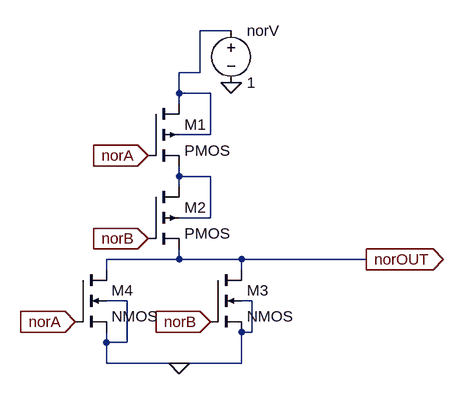
[diagram p0: schematic Draft7.asc]
Draft7.asc, the LTspice schematic file:
Version 4
SHEET 1 880 680
WIRE 320 -96 272 -96
WIRE 272 -32 272 -96
WIRE 272 -32 240 -32
WIRE 240 0 240 -32
WIRE 288 0 240 0
WIRE 240 16 240 0
WIRE 288 64 288 0
WIRE 288 64 240 64
WIRE 240 128 240 112
WIRE 288 128 240 128
WIRE 240 144 240 128
WIRE 288 192 288 128
WIRE 288 192 240 192
WIRE 240 256 240 240
WIRE 240 256 128 256
WIRE 336 256 240 256
WIRE 528 256 336 256
WIRE 128 272 128 256
WIRE 336 272 336 256
WIRE 160 320 128 320
WIRE 352 320 336 320
WIRE 352 368 352 320
WIRE 352 368 336 368
WIRE 128 384 128 368
WIRE 160 384 160 320
WIRE 160 384 128 384
WIRE 128 416 128 384
WIRE 240 416 128 416
WIRE 336 416 336 368
WIRE 336 416 240 416
FLAG 240 416 0
FLAG 320 -16 0
FLAG 192 96 norA
IOPIN 192 96 In
FLAG 192 224 norB
IOPIN 192 224 In
FLAG 80 352 norA
IOPIN 80 352 In
FLAG 288 352 norB
IOPIN 288 352 In
FLAG 528 256 norOUT
IOPIN 528 256 Out
SYMBOL pmos4 192 16 R0
SYMATTR InstName M1
SYMATTR Value2 l=32n w=64n
SYMBOL pmos4 192 144 R0
SYMATTR InstName M2
SYMATTR Value2 l=32n w=64n
SYMBOL nmos4 288 272 R0
SYMATTR InstName M3
SYMATTR Value2 l=32n w=64n
SYMBOL nmos4 80 272 R0
SYMATTR InstName M4
SYMATTR Value2 l=32n w=64n
SYMBOL voltage 320 -112 R0
WINDOW 123 0 0 Left 0
WINDOW 39 0 0 Left 0
SYMATTR InstName norV
SYMATTR Value 1

The netlist it stands for:
* Draft7.asc
M1 N001 norA N002 N001 PMOS l=32n w=64n
M2 N002 norB norOUT N002 PMOS l=32n w=64n
M3 norOUT norB 0 0 NMOS l=32n w=64n
M4 norOUT norA 0 0 NMOS l=32n w=64n
V§norV N001 0 1
.model NMOS NMOS
.model PMOS PMOS
.lib standard.mos
.backanno
.end